# EAGLE design Fake Alarm (EAGLE 9.6.2)
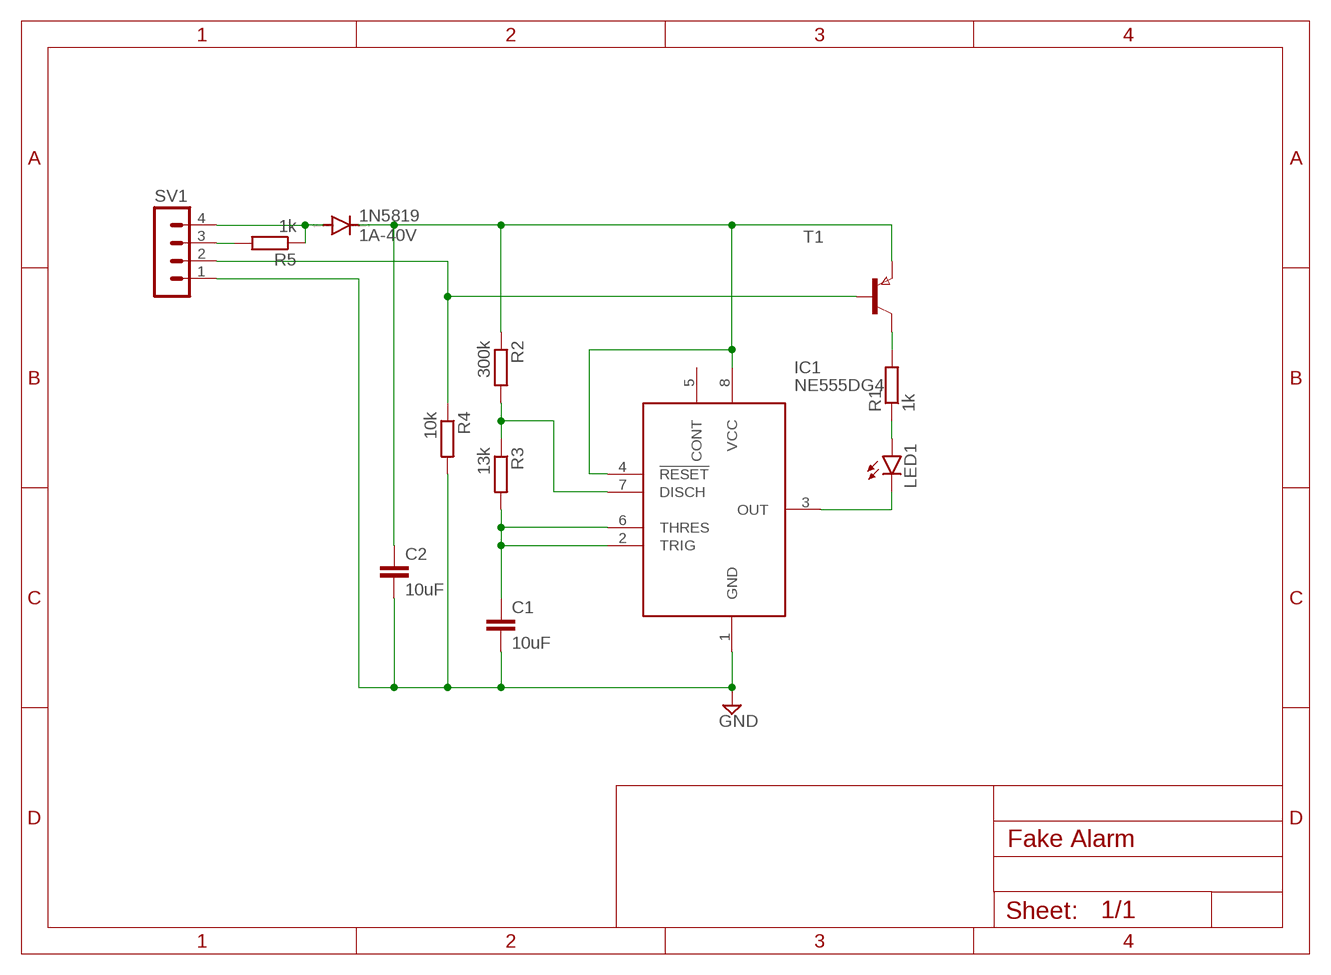
[diagram p0: schematic, sheet 1]

## Parts
1N5819  1A-40V  DIODE-DO214AC  [DO214AC]
C1  10uF  C-EUC0805K  [C0805K]
C2  10uF  C-EUC0805K  [C0805K]
IC1  NE555DG4  [SOIC127P600X175-8N]
LED1  LEDCHIP-LED0805  [CHIP-LED0805]
R1  1k  R-EU_M0805  [M0805]
R2  300k  R-EU_M0805  [M0805]
R3  13k  R-EU_M0805  [M0805]
R4  10k  R-EU_M0805  [M0805]
R5  1k  R-EU_M0805  [M0805]
SV1  MA04-1  [MA04-1]
T1  PNPSOT23  [SOT-23]

## Nets
GND: C1.2 C2.2 IC1.1(GND) R4.2 SV1.1
N$1: 1N5819.C C2.1 IC1.4(!RESET) IC1.8(VCC) R2.1 T1.2(E)
N$2: IC1.3(OUT) LED1.C
N$3: LED1.A R1.1
N$4: R1.2 T1.1(C)
N$5: R4.1 SV1.2 T1.3(B)
N$6: IC1.7(DISCH) R2.2 R3.1
N$7: C1.1 IC1.2(TRIG) IC1.6(THRES) R3.2
N$8: R5.2 SV1.3
N$9: 1N5819.A R5.1 SV1.4
Unconnected: IC1.5(CONT)

## Library data of the parts
1N5819 = diode:DIODE-: DIODE
C1 C2 = rcl:C-EU: CAPACITOR, European symbol; SPICEPREFIX: C
IC1 = SamacSys_Parts:NE555DG4: Timers & Support Products SINGLE PRECISION TIMER Source: Datasheet <http://www.mouser.com/ds/2/405/ne555-557499.pdf>; ARROW_PART_NUMBER: NE555DG4; ARROW_PRICE-STOCK: https://www.arrow.com/en/products/ne555dg4/texas-instruments; DESCRIPTION: Timers & Support Products SINGLE PRECISION TIMER; HEIGHT: 1.75mm; MANUFACTURER_NAME: Texas Instruments; MANUFACTURER_PART_NUMBER: NE555DG4; MOUSER_PART_NUMBER: 595-NE555DG4; MOUSER_PRICE-STOCK: https://www.mouser.co.uk/ProductDetail/Texas-Instruments/NE555DG4/?qs=rLYyFdxB%2FmoTBxH9w0Er2A%3D%3D
LED1 = led:LED: LED OSRAM: - CHIPLED LG R971, LG N971, LY N971, LG Q971, LY Q971, LO R971, LY R971 LH N974, LH R974 LS Q976, LO Q976, LY Q976 LO Q996 - Hyper CHIPLED LW Q18S LB Q993, LB Q99A, LB R99A - SideLED LS A670, LO A670, LY A670, LG A670, LP A670 LB A673, LV A673, LT A673, LW A673 LH A674 LY A675 LS A676, LA A676, LO A676, LY A676, LW A676 LS A679, LY A679, LG A679 - Hyper Micro SIDELED® LS Y876, LA Y876, LO Y876, LY Y876 LT Y87S - SmartLED LW L88C, LW L88S LB L89C, LB L89S, LG L890 LS L89K, LO L89K, LY L89K LS L896, LA L896, LO L896, LY L896 - TOPLED LS T670, LO T670, LY T670, LG T670, LP T670 LSG T670, LSP T670, LSY T670, LOP T670, LYG T670 LG T671, LOG T671, LSG T671 LB T673, LV T673, LT T673, LW T673 LH T674 LS T676, LA T676, LO T676, LY T676, LB T676, LH T676, LSB T676, LW T676 LB T67C, LV T67C, LT T67C, LS T67K, LO T67K, LY T67K, LW E67C LS E67B, LA E67B, LO E67B, LY E67B, LB E67C, LV E67C, LT E67C LW T67C LS T679, LY T679, LG T679 LS T770, LO T770, LY T770, LG T770, LP T770 LB T773, LV T773, LT T773, LW T773 LH T774 LS E675, LA E675, LY E675, LS T675 LS T776, LA T776, LO T776, LY T776, LB T776 LHGB T686 LT T68C, LB T68C - Hyper Mini TOPLED® LB M676 - Mini TOPLED Santana® LG M470 LS M47K, LO M47K, LY M47K Source: http://www.osram.convergy.de LUXEON: - LUMILED® LXK2-PW12-R00, LXK2-PW12-S00, LXK2-PW14-U00, LXK2-PW14-V00 LXK2-PM12-R00, LXK2-PM12-S00, LXK2-PM14-U00 LXK2-PE12-Q00, LXK2-PE12-R00, LXK2-PE12-S00, LXK2-PE14-T00, LXK2-PE14-U00 LXK2-PB12-K00, LXK2-PB12-L00, LXK2-PB12-M00, LXK2-PB14-N00, LXK2-PB14-P00, LXK2-PB14-Q00 LXK2-PR12-L00, LXK2-PR12-M00, LXK2-PR14-Q00, LXK2-PR14-R00 LXK2-PD12-Q00, LXK2-PD12-R00, LXK2-PD12-S00 LXK2-PH12-R00, LXK2-PH12-S00 LXK2-PL12-P00, LXK2-PL12-Q00, LXK2-PL12-R00 Source: www.luxeon.com KINGBRIGHT: KA-3528ASYC Source: www.kingbright.com
R1-R5 = resistor:R-EU_: RESISTOR, European symbol
SV1 = con-lstb:MA04-1: PIN HEADER; OC_FARNELL: unknown; OC_NEWARK: unknown
T1 = zetex:PNPSOT23: PNP TRANSISTOR; MPN: DSS20200L-7; OC_FARNELL: unknown; OC_NEWARK: 25R4554

## Board
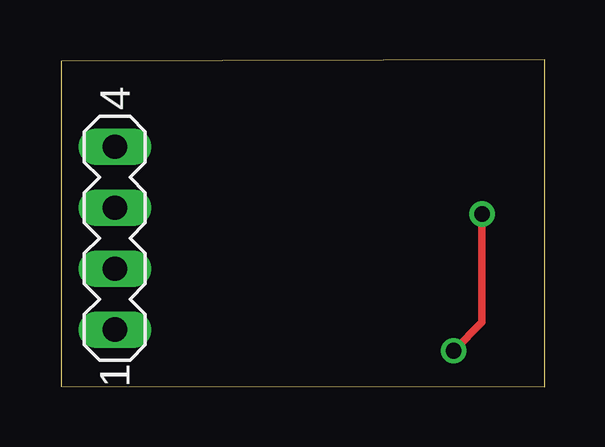
[diagram p1: board, top side]
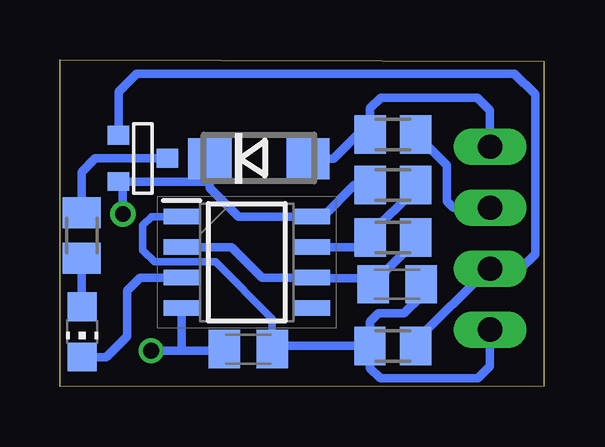
[diagram p2: board, bottom side, seen from below]

Size 20.17 x 13.62 mm. Coordinates in mm from the lower left corner, seen from the top.
Outline: 0,13.57 0,0.03 20.17,0 20.17,13.62 0,13.57
Copper layers (1*16): Top 0.035mm / dielectric 1.5mm / Bottom 0.035mm
Design rules "default": minimum track width 6mil, minimum drill 0.35mm, track to track 6mil, track to pad 6mil, pad to pad 6mil, via to via 6mil, smd to smd 6mil, copper to edge 40mil, drill to drill 6mil, minimum pad ring 10mil, minimum via ring 8mil, stop-mask expansion 4mil, vias tented up to drill 0mil, thermal gap 10mil

### Footprints (pad centres in the part's own frame; a part is rotated, then mirrored left to right if it is on the bottom)
DO214AC = smd 1.8 x 1.7: A 2.05,0; C -2.05,0
C0805K = smd 1.3 x 1.6: 1 -1,0; 2 1,0
SOIC127P600X175-8N = smd 1.525 x 0.65: 1 -2.712,1.905; 2 -2.712,0.635; 3 -2.712,-0.635; 4 -2.712,-1.905; 5 2.712,-1.905; 6 2.712,-0.635; 7 2.712,0.635; 8 2.712,1.905
CHIP-LED0805 = smd 1.2 x 1.2: A 0,-1.05; C 0,1.05
M0805 = smd 1.3 x 1.6: 1 -0.95,0; 2 0.95,0
MA04-1 = drill 1.016 long: 1 -3.81,0; 2 -1.27,0; 3 1.27,0; 4 3.81,0
SOT-23 = smd 0.787 x 0.889: 1 0.025,-1.016; 2 -0.94,1.016; 3 0.991,1.016

### Placement (x,y rotation side)
1N5819  11.87,9.51 0 bottom
C1  6.11,4.28 0 bottom
C2  12.32,1.57 0 bottom
IC1  12.38,5.19 0 bottom
LED1  19.24,2.3 180 bottom
R1  19.26,6.31 90 bottom
R2  6.28,8.42 0 bottom
R3  6.28,6.24 0 bottom
R4  6.29,1.72 180 bottom
R5  6.28,10.53 0 bottom
SV1  2.24,6.2 90 top
T1  16.71,9.5 90 bottom

### Tracks (layer width: path | path; a pad name or v marks a point on that pad's centre or on a via)
GND
  Bottom 0.305: IC1.1 16.35,7.1 16.71,6.73 16.71,5.69 16.23,5.21 13.69,5.21 11.32,2.84 C2.2
  Bottom 0.356: R4.2 11.18,1.72 C2.2 | R4.2 7.24,2.72 6.88,3.07 5.82,3.07 5.11,3.78 C1.2 | SV1.1 2.23,0.86 2.74,0.36 6.81,0.36 7.24,0.79 R4.2
N$1  (via drill 0.65)
  Top 0.305: v17.55,7.21 17.55,2.7 v16.37,1.51
  Bottom 0.356: R2.1 7.88,8.42 9.2,7.1 IC1.8 12.71,7.1 13.92,8.3 1N5819.C 13.92,8.75 14.11,8.56 T1.2 17.55,8.38 v17.55,7.21 | C2.1 13.38,1.51 v16.37,1.51 15.09,1.51 IC1.4
N$2
  Bottom 0.356: IC1.3 16.83,4.56 17.37,4.01 17.37,2.11 18.24,1.25 LED1.C
N$3
  Bottom 0.356: R1.1 19.26,3.44 LED1.A
N$4
  Bottom 0.356: R1.2 19.26,8.96 18.69,9.53 T1.1
N$5
  Bottom 0.356: R4.1 5.34,1.9 2.31,4.93 SV1.2 0.96,4.93 0.36,5.54 0.36,12.19 1.22,13.06 16.97,13.06 17.73,12.29 T1.3
N$6
  Bottom 0.356: 9.01,5.83 IC1.7 7.64,5.83 R3.1 7.23,6.37 5.33,8.27 R2.2
N$7
  Bottom 0.356: IC1.2 13.01,5.83 11.74,4.56 IC1.6 9.64,4.53 7.36,4.53 C1.1 7.11,4.33 5.33,6.1 R3.2
N$8
  Bottom 0.356: 5.33,10.27 R5.2 4.04,9.25 4.04,7.75 3.76,7.47 SV1.3 2.21,7.47
N$9
  Bottom 0.356: 1N5819.A 8.76,9.51 7.74,10.53 R5.1 7.23,11.61 6.79,12.05 2.75,12.05 2.23,11.53 SV1.4